# EAGLE design signal_interface2 (EAGLE 6.5.0)
Signal Interfacing Board
AUTHOR: Pasakorn Tiwatthanont; REV: 1
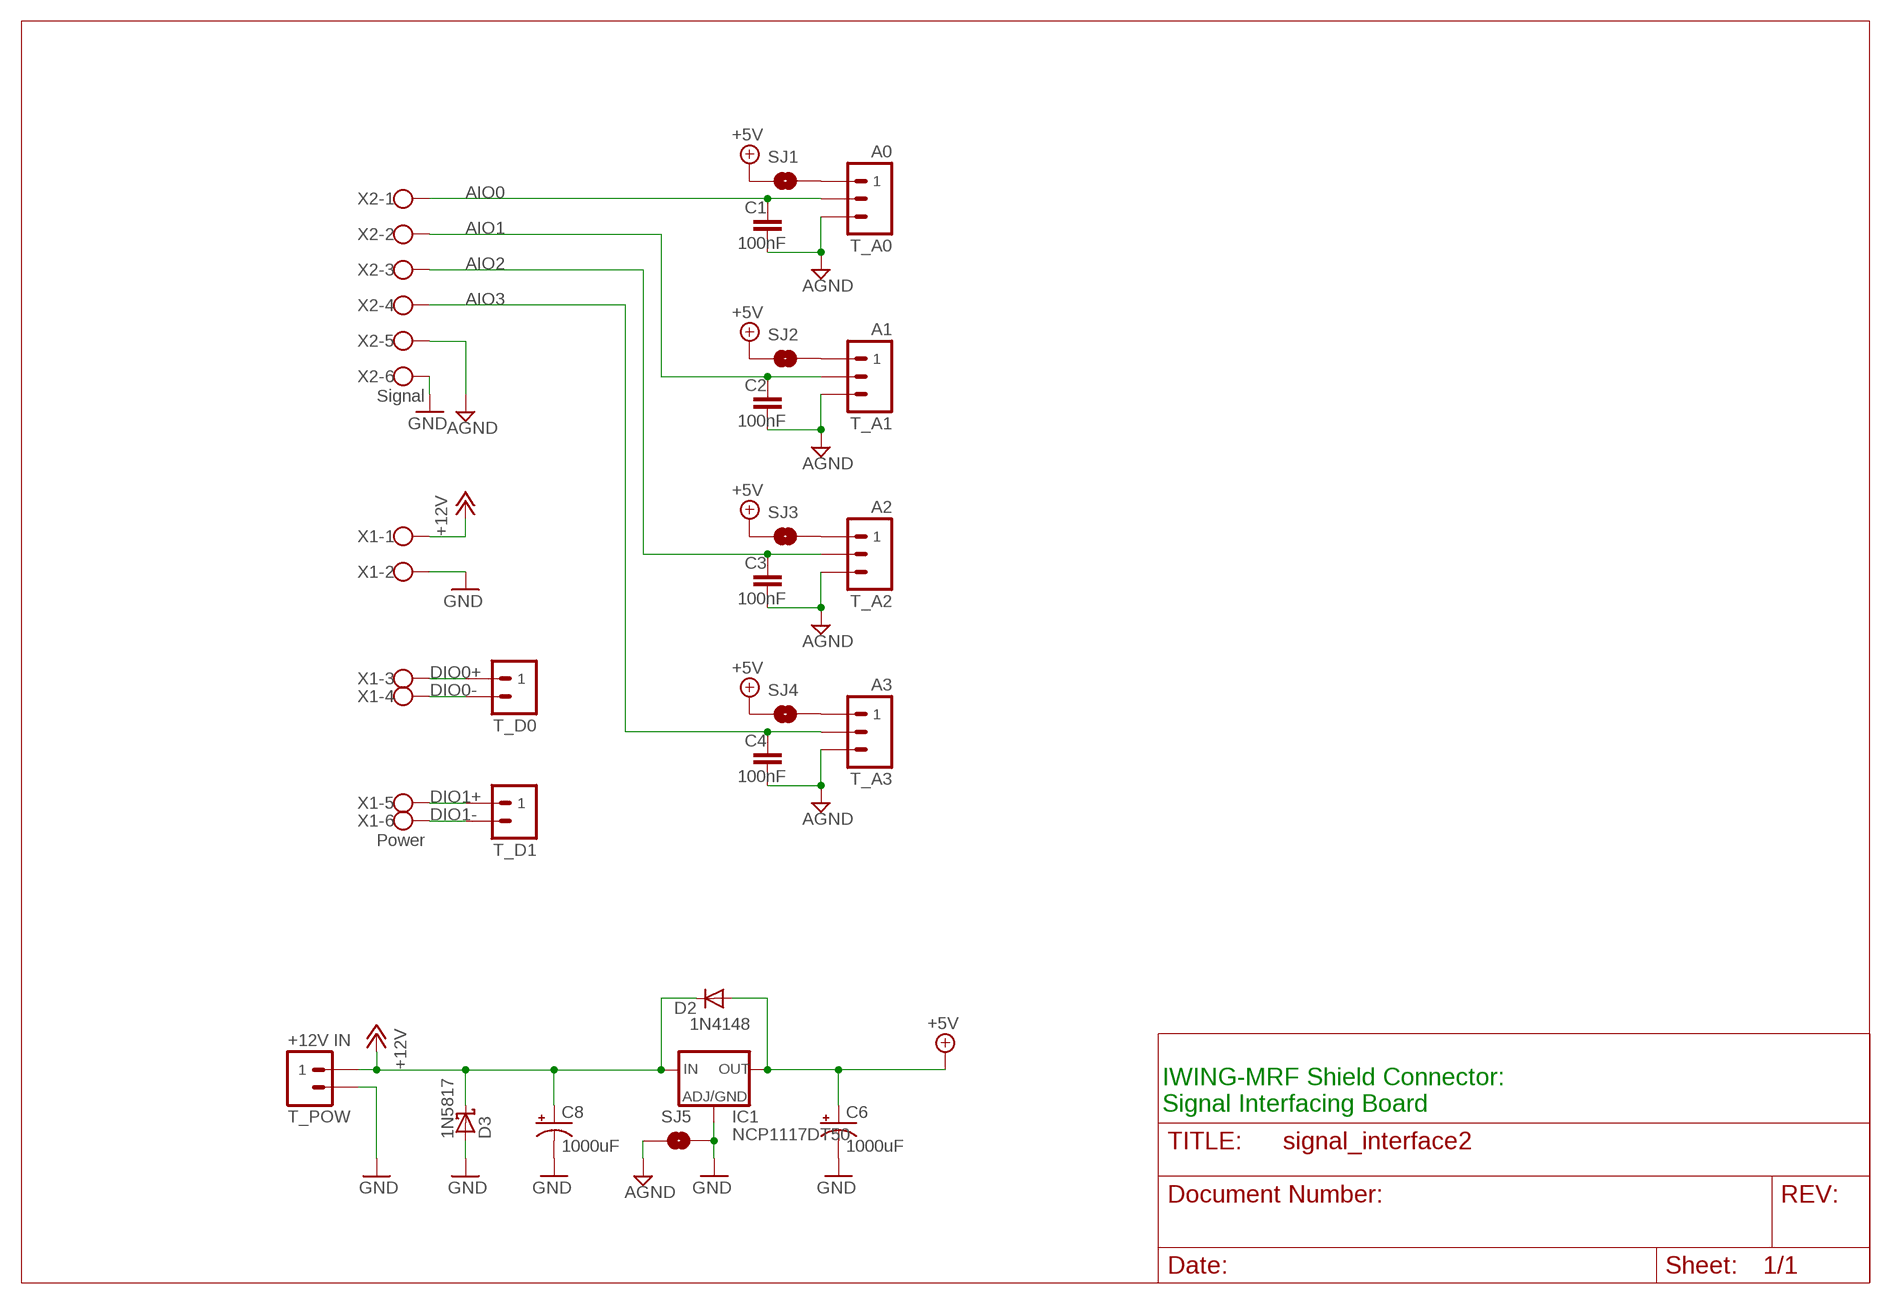
[diagram p0: schematic, sheet 1]

## Parts
C1  100nF  RCL_C-EU050-025X075  [RCL_C050-025X075]
C2  100nF  RCL_C-EU050-025X075  [RCL_C050-025X075]
C3  100nF  RCL_C-EU050-025X075  [RCL_C050-025X075]
C4  100nF  RCL_C-EU050-025X075  [RCL_C050-025X075]
C6  1000uF  RCL_CPOL-USE5-13  [RCL_E5-13]
C8  1000uF  RCL_CPOL-USE5-13  [RCL_E5-13]
D2  1N4148  1N4148-V  [DO35-100V]
D3  1N5817  1N5819-V  [DO41-150V]
IC1  NCP1117DT50  [DPACK]
SJ1  SOLDERJUMPERNC  [SJ_2S]
SJ2  SOLDERJUMPERNC  [SJ_2S]
SJ3  SOLDERJUMPERNC  [SJ_2S]
SJ4  SOLDERJUMPERNC  [SJ_2S]
SJ5  SOLDERJUMPERTRACE  [SJ_2S-TRACE]
T_A0  A0  ST03-5MM  [EK500V-03P]
T_A1  A1  ST03-5MM  [EK500V-03P]
T_A2  A2  ST03-5MM  [EK500V-03P]
T_A3  A3  ST03-5MM  [EK500V-03P]
T_D0  ST02-5MM  [EK500V-02P]
T_D1  ST02-5MM  [EK500V-02P]
T_POW  +12V IN  ST02-5MM  [EK500V-02P]
X1  Power  5EHDRC-6P  [5EHDRC-6P]
X2  Signal  5EHDRC-6P  [5EHDRC-6P]

## Nets
+5V: C6.+ D2.A IC1.4(OUT) SJ1.1 SJ2.1 SJ3.1 SJ4.1
+12V: C8.+ D2.C D3.C IC1.3(IN) T_POW.P$1 X1.1
AGND: C1.2 C2.2 C3.2 C4.2 SJ5.1 T_A0.P$3 T_A1.P$3 T_A2.P$3 T_A3.P$3 X2.5
AIO0: C1.1 T_A0.P$2 X2.1
AIO1: C2.1 T_A1.P$2 X2.2
AIO2: C3.1 T_A2.P$2 X2.3
AIO3: C4.1 T_A3.P$2 X2.4
DIO0+: T_D0.P$1 X1.3
DIO0-: T_D0.P$2 X1.4
DIO1+: T_D1.P$1 X1.5
DIO1-: T_D1.P$2 X1.6
GND [power]: C6.- C8.- D3.A IC1.1(ADJ) SJ5.2 T_POW.P$2 X1.2 X2.6
N$1: SJ1.2 T_A0.P$1
N$2: SJ2.2 T_A1.P$1
N$3: SJ3.2 T_A2.P$1
N$4: SJ4.2 T_A3.P$1

## Notes on the sheet
- IWING-MRF Shield Connector:
  Signal Interfacing Board

## Library data of the parts
C1-C4 = ipas:RCL_C-EU: CAPACITOR, European symbol
C6 C8 = SDI12IB_v0.5:RCL_CPOL-US: POLARIZED CAPACITOR, American symbol
D2 = ipas:1N4148: DIODE high speed (Philips)
D3 = ipas:1N5819: DIODE 1N5817 THRU 1N5819 1.0 AMP. Schottky Barrier Rectifiers Features Low forward voltage drop High current capability High reliability High surge current capability
IC1 = ipas:NCP1117?*: Low drop-out positive fixed and adjustable voltage regulator
SJ1-SJ5 = SparkFun-Passives:SOLDERJUMPER: Solder Jumper Standard SMD solder jumper. Used to automate production. Two varients : Normally Open and Normally Closed are the same, but have different paste layers. NC will have a large amount of paste and should jumper during reflow.
T_A0 T_A1-T_A3 = ipas:ST03: Dinkle® Screw Terminal Block - 3 Way -5MM: EK500V series. Rated at 20A, 300VAC. Cable size: 2mm² Supplier: Altronics P2035A Source: http://www.dinkle.com/upfiles/proter21253708953.pdf -3.5MM: ED350V series. Rated at 10A, 300VAC. Cable size: 1.4mm² Supplier: Altronics P2029 Source: http://www.dinkle.com/upfiles/proter21253714491.pdf
T_D0 T_D1 T_POW = ipas:ST02: Dinkle® Screw Terminal Block - 2 Way -5MM: EK500V series. Rated at 20A, 300VAC. Cable size: 2mm² Supplier: Altronics P2034A Source: http://www.dinkle.com/upfiles/proter21253708953.pdf -5.08MM: The back half of a EK500V4R-04P. Rated at 20A, 300VAC. Cable size: 2mm² Supplier: Altronics P2024 (half of) Source: http://www.dinkle.com/upfiles/proter21253708833.pdf -3.5MM: ED350V series. Rated at 10A, 300VAC. Cable size: 1.4mm² Supplier: Altronics P2028 Source: http://www.dinkle.com/upfiles/proter21253714491.pdf
X1 X2 = ipas:5EHDRC-6P: Dinkle Headers(Sockets) for pluggable terminal blocks / ECH & EHD series TERMINAL BLOCK, 300V/15A

## Net classes
0 default: width 0.254 mm
1 power: width 0.406 mm, clearance 0.203 mm

## Board
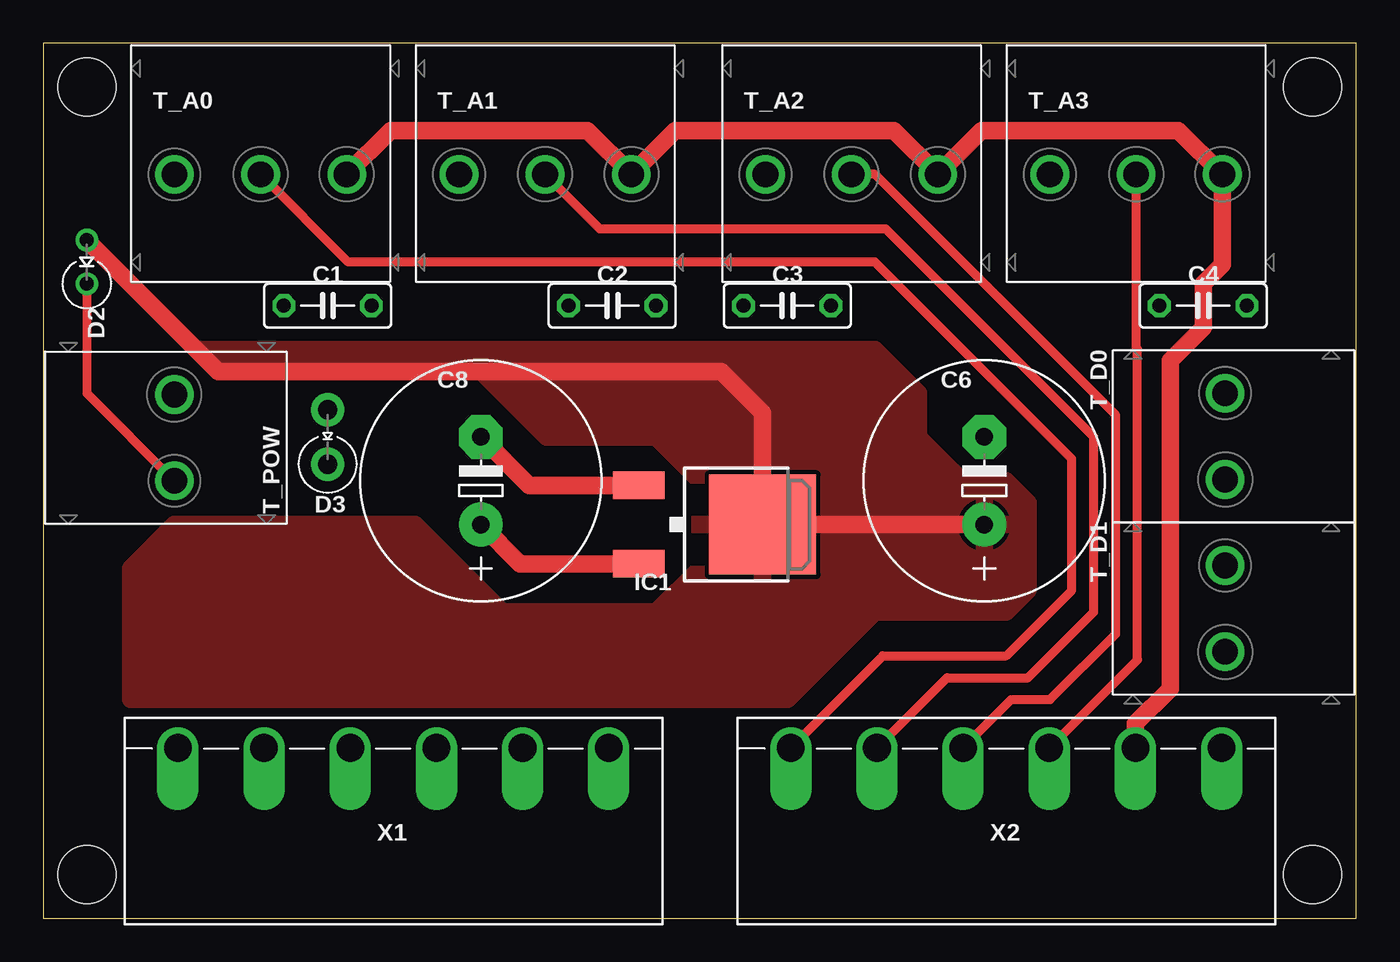
[diagram p1: board, top side]
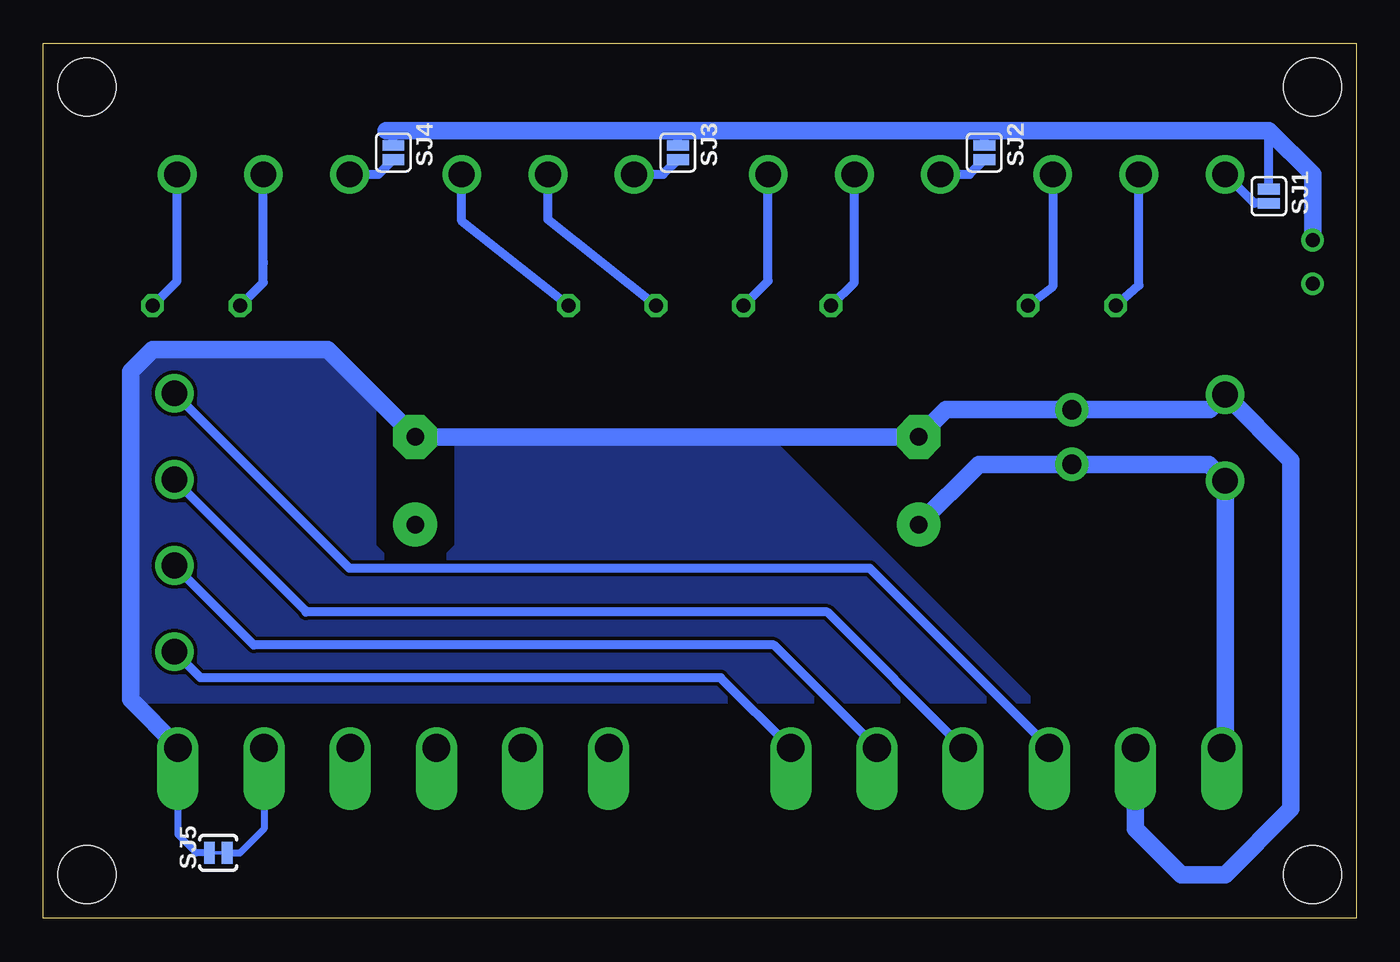
[diagram p2: board, bottom side, seen from below]

Size 76.2 x 50.8 mm. Coordinates in mm from the lower left corner, seen from the top.
Outline: 0,0 76.2,0 76.2,50.8 0,50.8 0,0
Copper layers (1*16): Top 0.035mm / dielectric 1.5mm / Bottom 0.035mm
Design rules "default": minimum track width 10mil, minimum drill 24mil, track to track 8mil, track to pad 8mil, pad to pad 8mil, via to via 8mil, smd to smd 8mil, copper to edge 40mil, drill to drill 8mil, minimum pad ring 10mil, minimum via ring 8mil, stop-mask expansion 4mil, vias tented up to drill 0mil, thermal gap 10mil
Holes 3.35 mm at 2.54,2.54 73.66,2.54 73.66,48.26 2.54,48.26

### Footprints (pad centres in the part's own frame; a part is rotated, then mirrored left to right if it is on the bottom)
RCL_C050-025X075 = drill 0.813 octagon: 1 -2.54,0; 2 2.54,0
RCL_E5-13 = drill 1.016 pad 2.54: + -2.54,0 | drill 1.016 pad 2.54 octagon: - 2.54,0
DO35-100V = drill 0.813: A 1.27,0; C -1.27,0
DO41-150V = drill 1.118 pad 1.93: A 1.587,0; C -1.587,0
DPACK = smd 1.6 x 3: 1 -2.28,-4.8; 3 2.28,-4.8 | smd 5.8 x 6.2: 4 0,2.38
SJ_2S = smd 0.635 x 1.27: 1 -0.412,0; 2 0.412,0
SJ_2S-TRACE = smd 0.635 x 1.27: 1 -0.508,0; 2 0.508,0
EK500V-03P = drill 1.5: P$1 0,0; P$2 5,0; P$3 10,0
EK500V-02P = drill 1.5: P$1 0,0; P$2 5,0
5EHDRC-6P = drill 1.6 offset: 1 -12.5,2.28; 2 -7.5,2.28; 3 -2.5,2.28; 4 2.5,2.28; 5 7.5,2.28; 6 12.5,2.28

### Placement (x,y rotation side)
C1  16.51,35.56 0 top
C2  33.02,35.56 0 top
C3  43.18,35.56 0 top
C4  67.31,35.56 0 top
C6  54.61,25.4 90 top
C8  25.4,25.4 90 top
D2  2.54,38.1 90 top
D3  16.51,27.94 90 top
IC1  39.37,22.86 270 top
SJ1  5.08,41.91 270 bottom
SJ2  21.59,44.45 270 bottom
SJ3  39.37,44.45 270 bottom
SJ4  55.88,44.45 270 bottom
SJ5  66.04,3.81 180 bottom
T_A0  7.62,43.18 0 top
T_A1  24.13,43.18 0 top
T_A2  41.91,43.18 0 top
T_A3  58.42,43.18 0 top
T_D0  68.58,30.48 270 top
T_D1  68.58,20.48 270 top
T_POW  7.62,25.4 90 top
X1  20.32,7.62 0 top
X2  55.88,7.62 0 top

### Tracks (layer width: path | path; a pad name or v marks a point on that pad's centre or on a via)
+5V
  Top 1.016: C6.+ IC1.4 41.75,29.37 39.37,31.75 10.16,31.75 D2.A
  Bottom 0.508: 20.73,45.72 20.32,45.72 | SJ1.1 5.08,45.72 | SJ2.1 21.59,45.72 22.86,45.72 | SJ3.1 39.37,45.72 40.64,45.72 | SJ4.1 55.88,45.72
  Bottom 1.016: D2.A 2.54,43.18 5.08,45.72 20.32,45.72 22.86,45.72 40.64,45.72 55.88,45.72 56.29,45.72
  pour Top: 8.89,33.02 10.16,31.75 25.4,31.75 29.21,27.94 35.56,27.94 38.1,25.4 38.1,20.32 35.56,17.78 26.67,17.78 21.59,22.86 7.62,22.86 5.08,20.32 5.08,12.7 43.18,12.7 48.26,17.78 55.88,17.78 57.15,19.05 57.15,24.13 55.88,25.4 53.34,25.4 50.8,27.94 50.8,30.48 48.26,33.02
+12V
  Top 0.508: D2.C 2.54,30.48 T_POW.P$1
  Top 1.016: C8.+ 27.68,20.58 IC1.3
  Bottom 1.016: X1.1 7.62,10.1 T_POW.P$1 8.57,26.35 D3.C 21.91,26.35 C8.+
AGND
  Top 1.016: X2.5 63.38,11.31 65.41,13.34 65.41,32.38 67.31,34.29 67.31,36.83 68.42,37.94 T_A3.P$3 65.88,45.72 54.45,45.72 T_A2.P$3 49.37,45.72 36.67,45.72 T_A1.P$3 31.59,45.72 20.16,45.72 T_A0.P$3
  Bottom 0.406: SJ5.1 64.77,3.81 63.38,5.2 X2.5
  Bottom 0.508: C1.2 17.62,36.67 T_A0.P$3 | C3.2 51.91,40.48 T_A2.P$3 | C2.2 34.13,36.99 T_A1.P$3 | C4.2 68.42,36.99 T_A3.P$3
AIO0
  Top 0.508: X2.1 48.72,15.24 55.88,15.24 59.69,19.05 59.69,26.67 48.26,38.1 17.7,38.1 T_A0.P$2
  Bottom 0.508: C1.1 12.62,36.75 T_A0.P$2
AIO1
  Top 0.508: X2.2 52.45,13.97 57.15,13.97 60.96,17.78 60.96,27.94 48.9,40.01 32.3,40.01 T_A1.P$2
  Bottom 0.508: C2.1 29.13,36.91 T_A1.P$2
AIO2
  Top 0.508: X2.3 56.18,12.7 58.42,12.7 62.23,16.51 62.23,29.21 48.26,43.18 T_A2.P$2
  Bottom 0.508: C3.1 46.91,40.56 T_A2.P$2
AIO3
  Top 0.508: X2.4 63.5,15.02 63.5,33.02 63.42,33.1 T_A3.P$2
  Bottom 0.508: T_A3.P$2 63.42,38.1 63.42,38.02 63.42,36.91 C4.1
DIO0+
  Bottom 0.508: X1.3 28.24,20.32 58.42,20.32 T_D0.P$1
DIO0-
  Bottom 0.508: X1.4 30.7,17.78 60.96,17.78 60.96,17.86 T_D0.P$2
DIO1+
  Bottom 0.508: X1.5 33.8,15.88 63.98,15.88 T_D1.P$1
DIO1-
  Bottom 0.508: X1.6 36.89,13.97 67.07,13.97 T_D1.P$2
GND
  Top 1.016: C8.- 28.2,25.14 IC1.1
  Bottom 0.406: SJ5.2 67.31,3.81 68.38,4.88 X2.6
  Bottom 1.016: X1.2 12.82,5.2 10.16,2.54 7.62,2.54 3.81,6.35 3.81,26.59 T_POW.P$2 8.49,29.53 D3.A 23.81,29.53 C8.- C6.- 59.69,33.02 69.85,33.02 71.12,31.75 71.12,12.7 68.38,9.96 X2.6
  pour Bottom: 19.05,12.7 71.12,12.7 71.12,31.75 69.85,33.02 59.69,33.02 57.15,30.48 57.15,21.59 55.88,20.32 53.34,20.32 52.07,21.59 52.07,27.94 34.29,27.94
N$1
  Bottom 0.508: SJ1.2 5.94,41.5 T_A0.P$1
N$2
  Bottom 0.508: T_A1.P$1 22.45,43.18 SJ2.2
N$3
  Bottom 0.508: T_A2.P$1 40.23,43.18 SJ3.2
N$4
  Bottom 0.508: T_A3.P$1 56.74,43.18 SJ4.2

### Text on the board
Document: +V | A? | GND | +12V | GND | D0+ | D0- | D1+ | D1- | A0 | A1 | A2 | A3